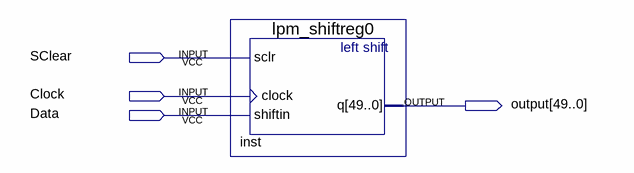
[diagram p0: schematic sheet]
// Quartus schematic 50bit_shift_register.bdf as structural Verilog: 1 symbols, 4 pins
module \50bit_shift_register  (
  input  SClear,
  input  Clock,
  input  Data,
  output [49:0] \output 
);

  lpm_shiftreg0 inst (.sclr(SClear), .clock(Clock), .shiftin(Data), .q(\output ));
endmodule
